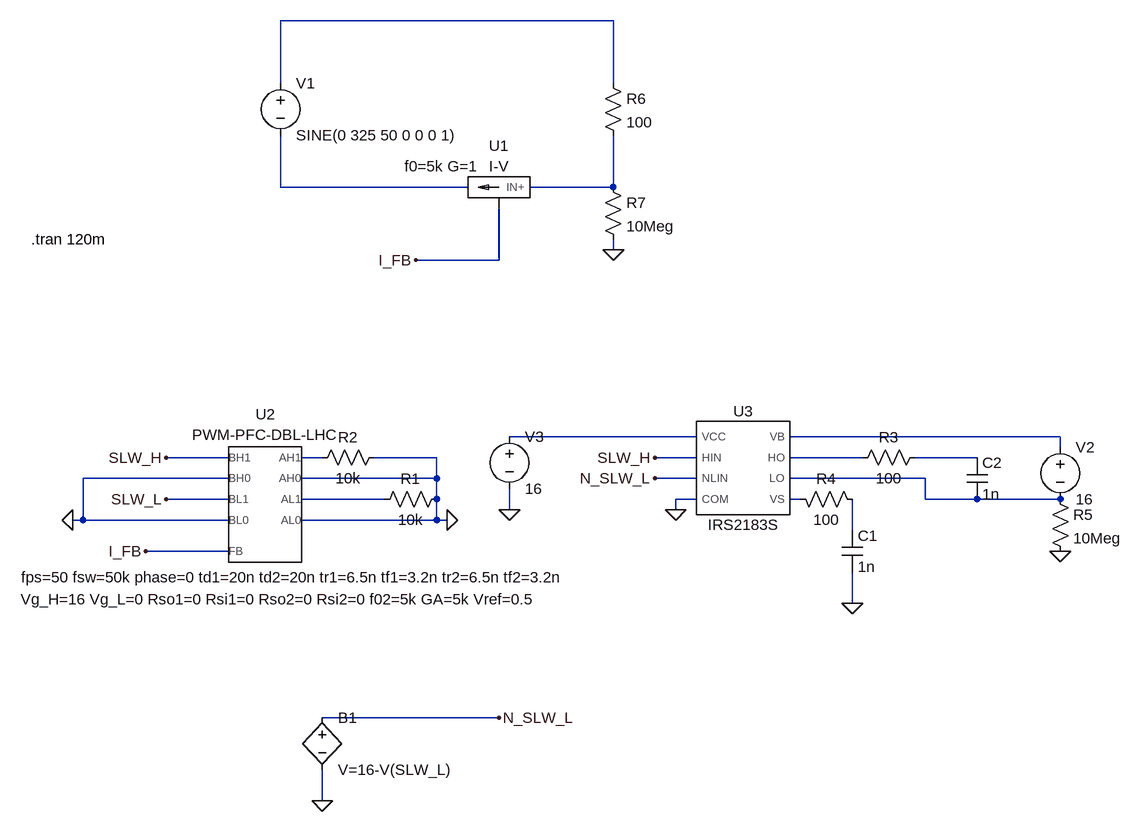
[diagram p0: schematic Driver_test.asc]
Driver_test.asc, the LTspice schematic file:
Version 4.1
SHEET 1 1108 1156
WIRE 320 -64 -192 -64
WIRE -192 32 -192 -64
WIRE 320 32 320 -64
WIRE -192 192 -192 112
WIRE 96 192 -192 192
WIRE 320 192 320 112
WIRE 320 192 192 192
WIRE 320 288 320 272
WIRE 144 304 144 224
WIRE 144 304 16 304
WIRE 448 576 160 576
WIRE 1008 576 592 576
WIRE 1008 592 1008 576
WIRE -272 608 -368 608
WIRE -128 608 -160 608
WIRE 48 608 -48 608
WIRE 448 608 384 608
WIRE 704 608 592 608
WIRE 880 608 784 608
WIRE -272 640 -496 640
WIRE 48 640 48 608
WIRE 48 640 -160 640
WIRE 448 640 384 640
WIRE 800 640 592 640
WIRE -272 672 -368 672
WIRE -32 672 -160 672
WIRE 48 672 48 640
WIRE 448 672 416 672
WIRE 608 672 592 672
WIRE 800 672 800 640
WIRE 880 672 800 672
WIRE 1008 672 880 672
WIRE 160 688 160 656
WIRE 416 688 416 672
WIRE -496 704 -496 640
WIRE -496 704 -512 704
WIRE -272 704 -496 704
WIRE 48 704 48 672
WIRE 48 704 -160 704
WIRE 64 704 48 704
WIRE 688 720 688 672
WIRE -272 752 -400 752
WIRE 688 832 688 784
WIRE 144 1008 -128 1008
WIRE -128 1136 -128 1088
FLAG 16 304 I_FB
FLAG -400 752 I_FB
FLAG -512 704 0
FLAG -368 608 SLW_H
FLAG -368 672 SLW_L
FLAG 64 704 0
FLAG 688 832 0
FLAG 1008 752 0
FLAG 160 688 0
FLAG 416 688 0
FLAG 384 608 SLW_H
FLAG 320 288 0
FLAG 144 1008 N_SLW_L
FLAG -128 1136 0
FLAG 384 640 N_SLW_L
SYMBOL I-V 128 192 M0
SYMATTR InstName U1
SYMBOL voltage -192 16 R0
WINDOW 123 0 0 Left 0
WINDOW 39 0 0 Left 0
SYMATTR InstName V1
SYMATTR Value SINE(0 325 50 0 0 0 1)
SYMBOL PWM-PFC-DBL-LHC -224 736 R0
SYMATTR InstName U2
SYMATTR SpiceLine fps=50 fsw=50k phase=0 td1=20n td2=20n tr1=6.5n tf1=3.2n tr2=6.5n tf2=3.2n
SYMATTR SpiceLine2 Vg_H=16 Vg_L=0 Rso1=0 Rsi1=0 Rso2=0 Rsi2=0 f02=5k GA=5k Vref=0.5
SYMBOL res 64 656 R90
WINDOW 0 0 56 VBottom 2
WINDOW 3 32 56 VTop 2
SYMATTR InstName R1
SYMATTR Value 10k
SYMBOL res -32 592 R90
WINDOW 0 0 56 VBottom 2
WINDOW 3 32 56 VTop 2
SYMATTR InstName R2
SYMATTR Value 10k
SYMBOL IRS2183S 512 624 R0
SYMATTR InstName U3
SYMBOL cap 672 720 R0
SYMATTR InstName C1
SYMATTR Value 1n
SYMBOL cap 864 608 R0
SYMATTR InstName C2
SYMATTR Value 1n
SYMBOL res 800 592 R90
WINDOW 0 0 56 VBottom 2
WINDOW 3 32 56 VTop 2
SYMATTR InstName R3
SYMATTR Value 100
SYMBOL res 592 656 M90
WINDOW 0 0 56 VBottom 2
WINDOW 3 32 56 VTop 2
SYMATTR InstName R4
SYMATTR Value 100
SYMBOL voltage 1008 576 R0
WINDOW 123 0 0 Left 0
WINDOW 39 0 0 Left 0
SYMATTR InstName V2
SYMATTR Value 16
SYMBOL res 992 656 R0
SYMATTR InstName R5
SYMATTR Value 10Meg
SYMBOL voltage 160 560 R0
WINDOW 123 0 0 Left 0
WINDOW 39 0 0 Left 0
SYMATTR InstName V3
SYMATTR Value 16
SYMBOL res 304 16 R0
SYMATTR InstName R6
SYMATTR Value 100
SYMBOL res 304 176 R0
SYMATTR InstName R7
SYMATTR Value 10Meg
SYMBOL bv -128 992 R0
SYMATTR InstName B1
SYMATTR Value V=16-V(SLW_L)
TEXT -576 272 Left 2 !.tran 120m

The netlist it stands for:
* Driver_test.asc
X§U1 N003 N002 I_FB I-V f0=5k G=1  ; pins IN+ IN- OUT
V1 N001 N002 SINE(0 325 50 0 0 0 1)
X§U2 N006 0 N010 0 SLW_H 0 SLW_L 0 I_FB PWM-PFC-DBL-LHC fps=50 fsw=50k phase=0 td1=20n td2=20n tr1=6.5n tf1=3.2n tr2=6.5n tf2=3.2n Vg_H=16 Vg_L=0 Rso1=0 Rsi1=0 Rso2=0 Rsi2=0 f02=5k GA=5k Vref=0.5  ; pins AH1 AH0 AL1 AL0 BH1 BH0 BL1 BL0 FB
R1 0 N010 10k
R2 0 N006 10k
X§U3 N009 N007 0 SLW_H N_SLW_L N004 N005 N011 IRS2183S  ; pins LO HO COM HIN NLIN VCC VB VS
C1 N012 0 1n
C2 N008 N009 1n
R3 N008 N007 100
R4 N011 N012 100
V2 N005 N009 16
R5 N009 0 10Meg
V3 N004 0 16
R6 N001 N003 100
R7 N003 0 10Meg
B1 N_SLW_L 0 V=16-V(SLW_L)
.tran 120m
.lib SS I-V.lib
.lib SS PWM-PFC-DBL-LHC.lib
.lib IRS2183S.lib
.backanno
.end